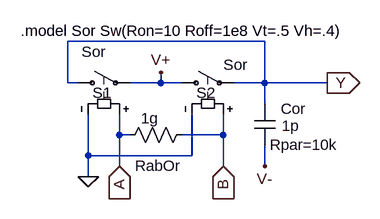
[diagram p0: schematic OrH.asc]
OrH.asc, the LTspice schematic file:
Version 4
SHEET 1 880 680
WIRE 16 240 16 176
WIRE 32 240 16 240
WIRE 48 352 48 288
WIRE 48 384 48 352
WIRE 96 320 96 288
WIRE 96 368 96 320
WIRE 112 320 96 320
WIRE 160 240 112 240
WIRE 160 240 160 224
WIRE 192 240 160 240
WIRE 208 352 48 352
WIRE 208 352 208 288
WIRE 256 320 192 320
WIRE 256 320 256 288
WIRE 256 368 256 320
WIRE 320 176 16 176
WIRE 320 240 272 240
WIRE 320 240 320 176
WIRE 320 272 320 240
WIRE 320 368 320 336
WIRE 416 240 320 240
FLAG 96 368 A
IOPIN 96 368 In
FLAG 256 368 B
IOPIN 256 368 In
FLAG 416 240 Y
IOPIN 416 240 Out
FLAG 320 368 V-
FLAG 160 224 V+
FLAG 48 384 0
SYMBOL sw 16 240 R270
WINDOW 0 -15 39 VRight 0
WINDOW 3 48 22 VRight 0
SYMATTR InstName S1
SYMATTR Value Sor
SYMBOL sw 176 240 R270
WINDOW 0 -15 39 VRight 0
WINDOW 3 28 80 VRight 0
SYMATTR InstName S2
SYMATTR Value Sor
SYMBOL res 208 304 R90
WINDOW 0 79 52 VBottom 0
WINDOW 3 -25 65 VTop 0
SYMATTR InstName RabOr
SYMATTR Value 1g
SYMBOL cap 304 272 R0
WINDOW 0 41 8 Left 0
WINDOW 3 42 34 Left 0
WINDOW 39 24 63 Left 0
SYMATTR InstName Cor
SYMATTR Value 1p
SYMATTR SpiceLine Rpar=10k
TEXT -56 160 Left 0 !.model Sor Sw(Ron=10 Roff=1e8 Vt=.5 Vh=.4)

The netlist it stands for:
* OrH.asc
S1 Y V+ A 0 Sor
S2 V+ Y B 0 Sor
RabOr B A 1g
Cor Y V- 1p Rpar=10k
.model Sor Sw(Ron=10 Roff=1e8 Vt=.5 Vh=.4)
.backanno
.end